# Altium schematic sheet usb_c_connection.SchDoc
size A; SheetNumber: 2; SheetTotal: 3
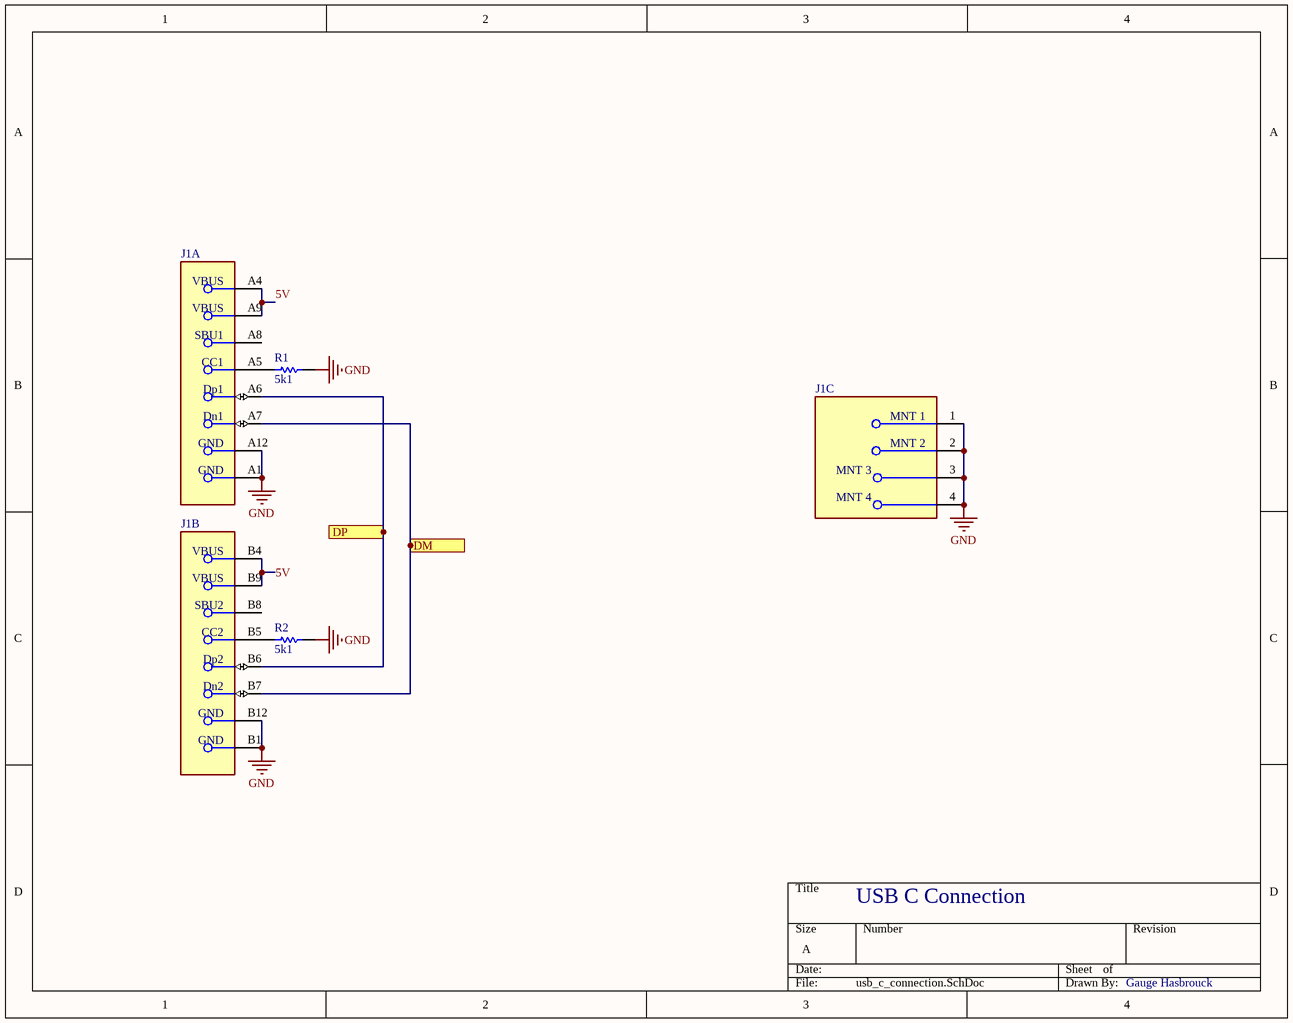
[diagram p0: usb_c_connection.SchDoc]

## Parts
J1  213716-0001  [FP-213716-0001-MFG]  (value not drawn)  (parts A,B,C of 3)
R1  5k1  [RESC1005X40X25NL05T10]
R2  5k1  [RESC1005X40X25NL05T10]

## Ports
DM (see main[1B]), DP (see main[1B])

## Nets
GND: J1.1(MNT_1) J1.2(MNT_2) J1.3(MNT_3) J1.4(MNT_4) J1.A1(GND) J1.A12(GND) J1.B1(GND) J1.B12(GND) R1.2 R2.2
5V: J1.A4(VBUS) J1.A9(VBUS) J1.B4(VBUS) J1.B9(VBUS)
DM: J1.A7(Dn1) J1.B7(Dn2) ; port DM
DP: J1.A6(Dp1) J1.B6(Dp2) ; port DP
NetJ1_A5: J1.A5(CC1) R1.1
NetJ1_B5: J1.B5(CC2) R2.1

Not connected (* = marked no-connect by the designer): J1 A8(SBU1) B8(SBU2)

## Notes on the sheet
- USB C Connection
- Gauge Hasbrouck

## Library data of the parts
J1 = CMP-04767-000029-1: CONN RCPT USB2.0 TYPE C 24POS RA
R1 R2 = CMP-2002-07753-1: Part Number: RC0402FR-075K1L; Manufacturer: Yageo / Phycomp